# Altium schematic sheet GPS.SchDoc: Módulo GPS
size A4; Engineer: Nuria Parra; Revision: 1
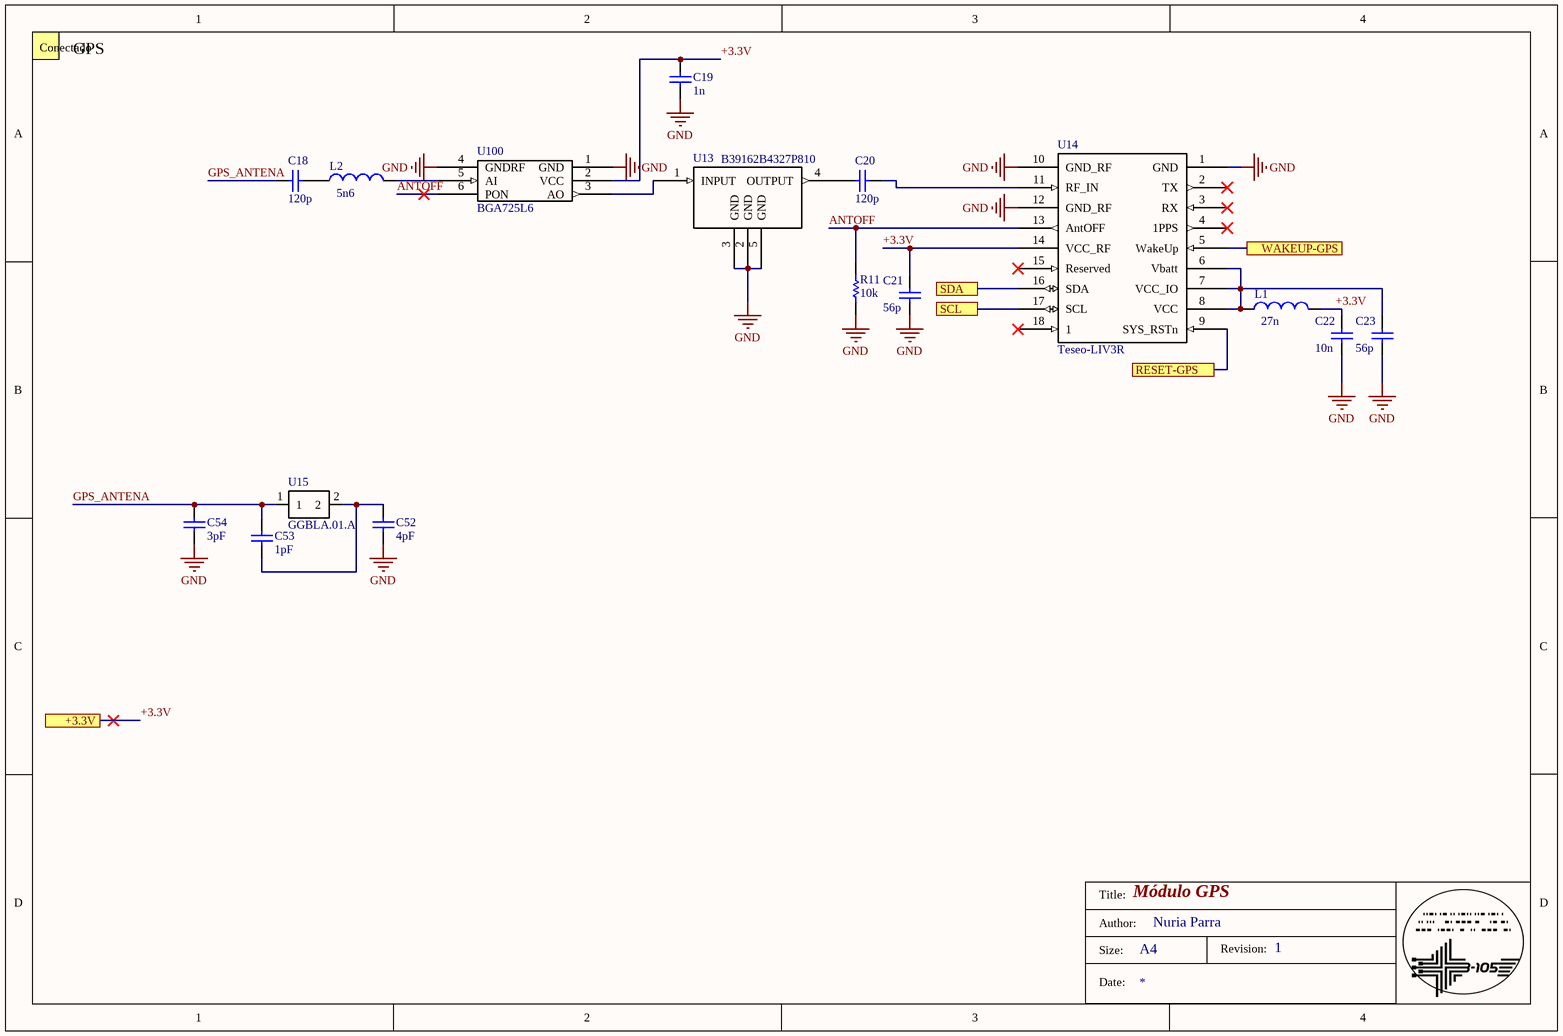
[diagram p0: GPS.SchDoc]

## Parts
C18  value 120p  [0402 CAP]  (hidden comment: Cap)
C19  value 1n  [0402 CAP]  (hidden comment: Cap)
C20  value 120p  [0402 CAP]  (hidden comment: Cap)
C21  value 56p  [0201 CAP]  (hidden comment: Cap)
C22  value 10n  [0201 CAP]  (hidden comment: Cap)
C23  value 56p  [0201 CAP]  (hidden comment: Cap)
C52  value 4pF  [0402 CAP]  (hidden comment: Cap)
C53  value 1pF  [0402 CAP]  (hidden comment: Cap)
C54  value 3pF  [0402 CAP]  (hidden comment: Cap)
L1  value 27n  [0402 IND]  (hidden comment: L?)
L2  value 5n6  [0402 IND]  (hidden comment: L?)
R11  10k  [0402 RES]
U13  B39162B4327P810  [B39162B4327P810]
U14  Teseo-LIV3R  [GPS]
U15  GGBLA.01.A  [GGBLA.01.A]
U100  BGA725L6  [BGA]

## Ports
+3.3V, RESET-GPS, SCL, SDA, WAKEUP-GPS

## Nets
GND: C19.2 C21.1 C22.1 C23.1 C52.2 C54.2 R11.1 U13.2(GND) U13.3(GND) U13.5(GND) U14.1(GND) U14.10(GND_RF) U14.12(GND_RF) U100.1(GND) U100.4(GNDRF)
+3.3V: C19.1 C21.2 C22.2 L1.2 U14.14(VCC_RF) U100.2(VCC) ; port +3.3V
ANTOFF: R11.2 U14.13(AntOFF) U100.6(PON)
GPS_ANTENA: C18.2 C53.1 C54.1 U15.1
RESET-GPS: U14.9(SYS_RSTn) ; port RESET-GPS
SCL: U14.17(SCL) ; port SCL
SDA: U14.16(SDA) ; port SDA
WAKEUP-GPS: U14.5(WakeUp) ; port WAKEUP-GPS
NetC18_1: C18.1 L2.1
NetC20_1: C20.1 U13.4(OUTPUT)
NetC20_2: C20.2 U14.11(RF_IN)
NetC23_2: C23.2 L1.1 U14.6(Vbatt) U14.7(VCC_IO) U14.8(VCC)
NetC52_1: C52.1 C53.2 U15.2
NetL2_2: L2.2 U100.5(AI)
NetU13_1: U13.1(INPUT) U100.3(AO)

Not connected (* = marked no-connect by the designer): U14 2(TX)* 3(RX)* 4(1PPS)* 15(Reserved)* 18(1)*

## Notes on the sheet
- Conectado por I2C
- GPS
- Title:
- Size:
- Author:
- Date:
- A4
- Revision:

## Library data of the parts
L1 L2 = Ind
R11 = Res: Value: 1K
U14 = GPS